# EAGLE design esp8266-dev (EAGLE 7.1.0)
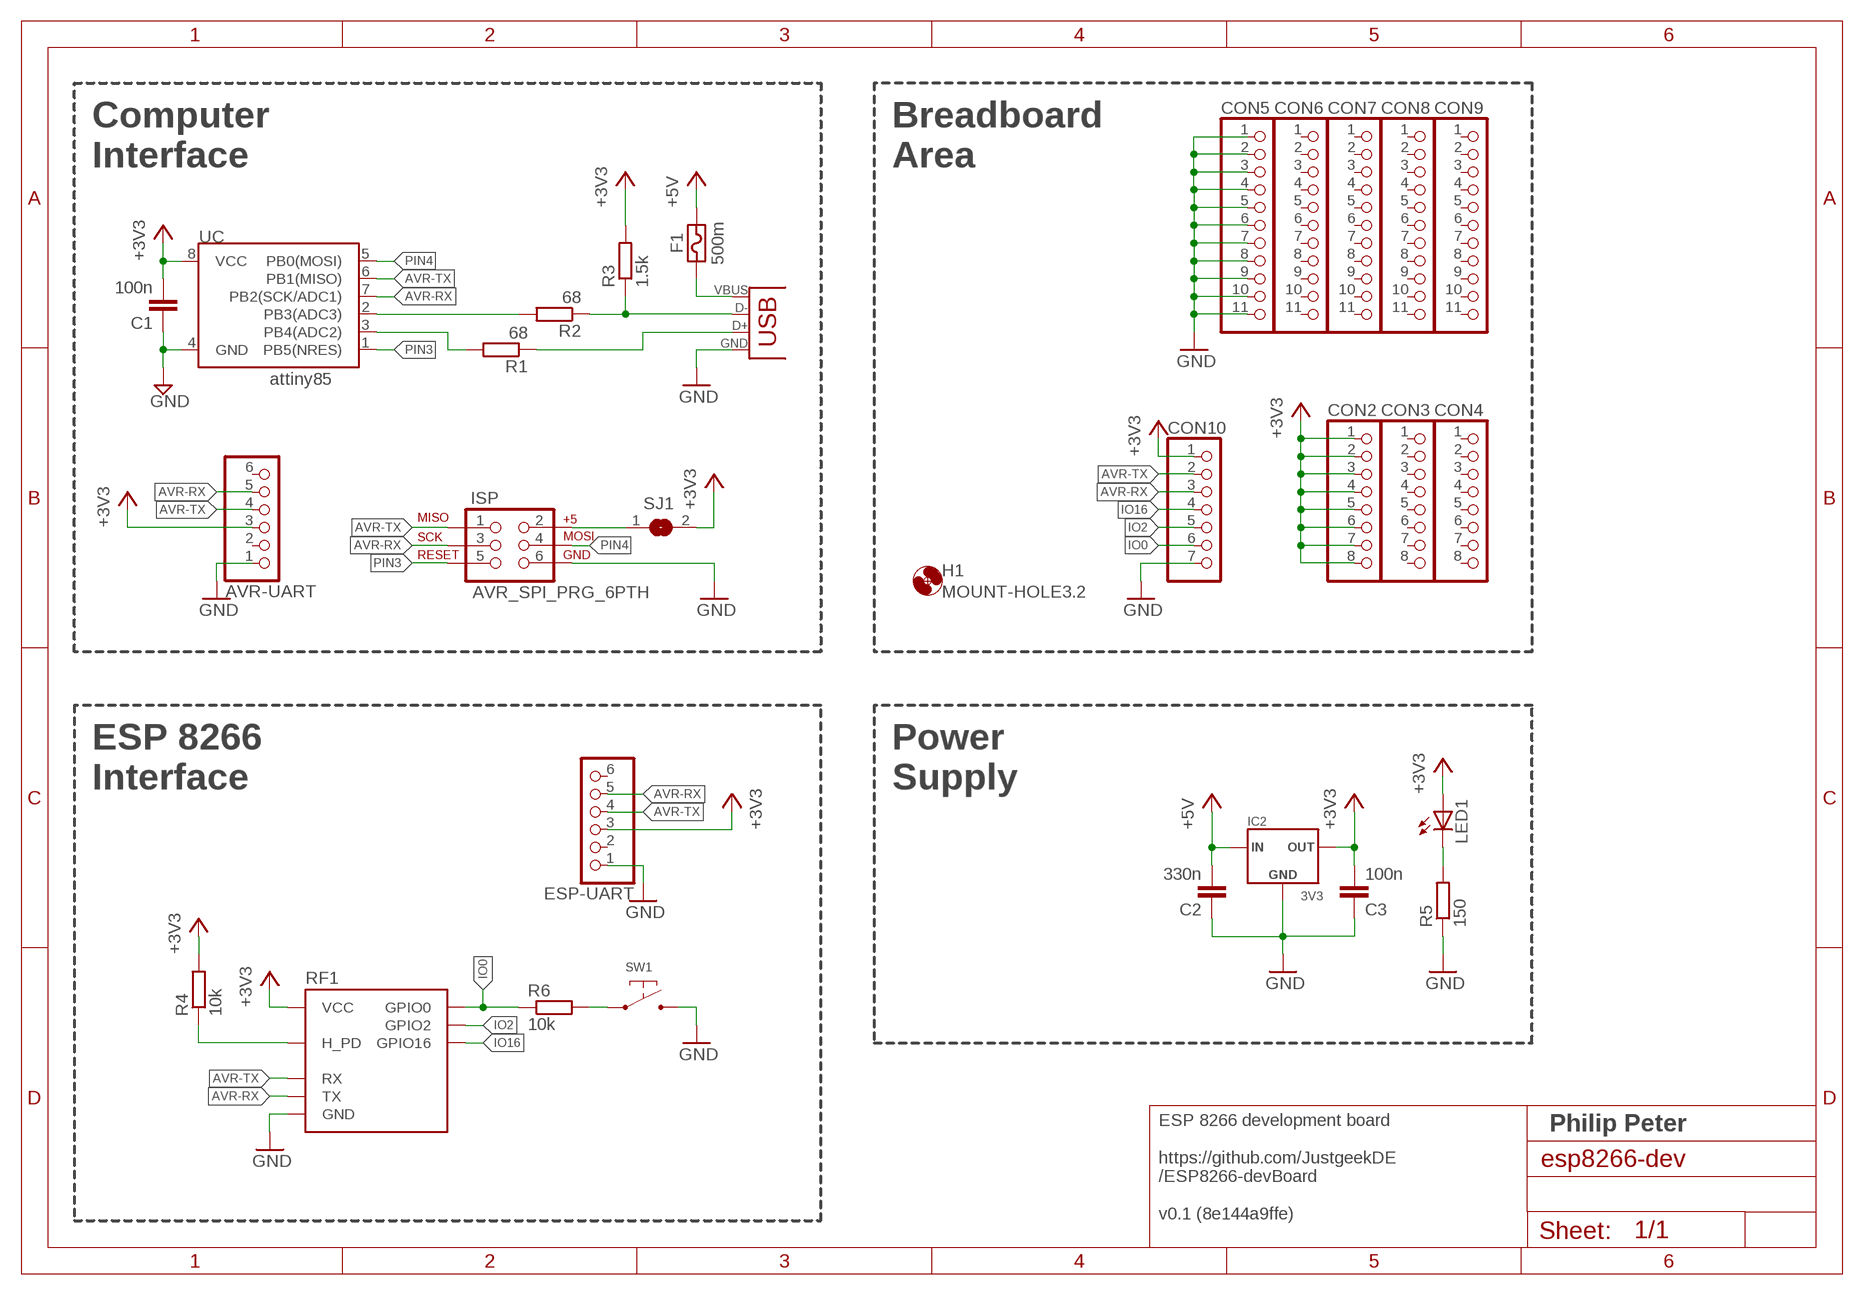
[diagram p0: schematic, sheet 1]

## Parts
AVR-UART  GENERIC-1X6STANDARD  [PINHEADER-100MIL-1X6]
C1  100n  C-EU025-025X050  [C025-025X050]
C2  330n  C-EU025-025X050  [C025-025X050]
C3  100n  C-EU025-025X050  [C025-025X050]
CON1  USBB-SOCKET  [PN61729-S]
CON2  GENERIC-1X8NOSILK  [PINHEADER-100MIL-1X8-NOSILK]
CON3  GENERIC-1X8NOSILK  [PINHEADER-100MIL-1X8-NOSILK]
CON4  GENERIC-1X8NOSILK  [PINHEADER-100MIL-1X8-NOSILK]
CON5  GENERIC-1X11NOSILK  [PINHEADER-100MIL-1X11-NOSILK]
CON6  GENERIC-1X11NOSILK  [PINHEADER-100MIL-1X11-NOSILK]
CON7  GENERIC-1X11NOSILK  [PINHEADER-100MIL-1X11-NOSILK]
CON8  GENERIC-1X11NOSILK  [PINHEADER-100MIL-1X11-NOSILK]
CON9  GENERIC-1X11NOSILK  [PINHEADER-100MIL-1X11-NOSILK]
CON10  GENERIC-1X7NOSILK  [PINHEADER-100MIL-1X7-NOSILK]
ESP-UART  GENERIC-1X6STANDARD  [PINHEADER-100MIL-1X6]
F1  500m  FUSETHT-5.1  [FUSE-THT-100-MIL]
H1  MOUNT-HOLE3.2  [3,2]
IC2  3V3  REGULATOR-UA78M33TO220  [TO220V]
ISP  AVR_SPI_PRG_6PTH  [2X3]
LED1  LED3MM  [LED3MM]
R1  68  R-EU_0204/7  [0204/7]
R2  68  R-EU_0204/7  [0204/7]
R3  1.5k  R-EU_0204/7  [0204/7]
R4  10k  R-EU_0204/7  [0204/7]
R5  150  R-EU_0204/7  [0204/7]
R6  10k  R-EU_0204/7  [0204/7]
RF1  ESP2866-ESP-01THT-NOSILK  [ESP8266-ESP-01-NOSILK]
SJ1  SJ  [SJ]
SW1  SWITCH-DEFAULT_OFF-DEFAULT  [SWITCH-GENERIC-4_PIN]
UC  ATTINY85  ATTINY45DIP8  [DIP08]

## Nets
+3V3: AVR-UART.3 C1.2 C3.2 CON2.1 CON2.2 CON2.3 CON2.4 CON2.5 CON2.6 CON2.7 CON2.8 CON10.1 ESP-UART.3 IC2.3(OUT) LED1.A R3.2 R4.2 RF1.VCC SJ1.2 UC.8(VCC)
+5V: C2.2 F1.P$2 IC2.1(IN)
AVR-RX: AVR-UART.5 CON10.3 ESP-UART.5 ISP.3 RF1.TX UC.7(PB2(SCK/ADC1))
AVR-TX: AVR-UART.4 CON10.2 ESP-UART.4 ISP.1 RF1.RX UC.6(PB1(MISO))
D+: CON1.3(D+) R1.1
D-: CON1.2(D-) R2.1 R3.1
GND: AVR-UART.1 C1.1 C2.1 C3.1 CON1.4(GND) CON5.1 CON5.2 CON5.3 CON5.4 CON5.5 CON5.6 CON5.7 CON5.8 CON5.9 CON5.10 CON5.11 CON10.7 ESP-UART.1 IC2.2(GND) ISP.6 R5.1 RF1.GND SW1.P$3 SW1.P$4 UC.4(GND)
IO0: CON10.6 R6.1 RF1.GPIO0
IO2: CON10.5 RF1.GPIO2
IO16: CON10.4 RF1.GPIO16
N$1: R2.2 UC.2(PB3(ADC3))
N$2: R1.2 UC.3(PB4(ADC2))
N$3: LED1.K(C) R5.2
N$4: CON1.1(VBUS) F1.P$1
N$6: R4.1 RF1.H_PD
N$8: R6.2 SW1.P$1 SW1.P$2
PIN3: ISP.5 UC.1(PB5(NRES))
PIN4: ISP.4 UC.5(PB0(MOSI))
VCC_HEADER: ISP.2 SJ1.1
Unconnected: AVR-UART.2 AVR-UART.6 CON3.1 CON3.2 CON3.3 CON3.4 CON3.5 CON3.6 CON3.7 CON3.8 CON4.1 CON4.2 CON4.3 CON4.4 CON4.5 CON4.6 CON4.7 CON4.8 CON6.1 CON6.2 CON6.3 CON6.4 CON6.5 CON6.6 CON6.7 CON6.8 CON6.9 CON6.10 CON6.11 CON7.1 CON7.2 CON7.3 CON7.4 CON7.5 CON7.6 CON7.7 CON7.8 CON7.9 CON7.10 CON7.11 CON8.1 CON8.2 CON8.3 CON8.4 CON8.5 CON8.6 CON8.7 CON8.8 CON8.9 CON8.10 CON8.11 CON9.1 CON9.2 CON9.3 CON9.4 CON9.5 CON9.6 CON9.7 CON9.8 CON9.9 CON9.10 CON9.11 ESP-UART.2 ESP-UART.6

## Notes on the sheet
- Computer
  Interface
- Breadboard
  Area
- attiny85
- ESP 8266
  Interface
- Power
  Supply
- ESP 8266 development board
  
  https://github.com/JustgeekDE
  /ESP8266-devBoard
  
  v0.1 (8e144a9ffe)
- Philip Peter

## Library data of the parts
AVR-UART ESP-UART = p.peter-connectors:GENERIC-1X6
C1-C3 = rcl:C-EU: CAPACITOR, European symbol
CON1 = p.peter-connectors:USB
CON2-CON4 = p.peter-connectors:GENERIC-1X8
CON5-CON9 = p.peter-connectors:GENERIC-1X11
CON10 = p.peter-connectors:GENERIC-1X7
F1 = p.peter-regulators:FUSE
H1 = holes:MOUNT-HOLE: MOUNTING HOLE with drill center marker
IC2 = p.peter-regulators:REGULATOR-UA78M33
ISP = SparkFun:AVR_SPI_PRG_6: AVR ISP 6 Pin This is the reduced ISP connector for AVR programming. Common on Arduino. This footprint will take up less PCB space and can be used with a 10-pin to 6-pin adapter such as SKU: BOB-08508
LED1 = led:LED: LED OSRAM: - CHIPLED LG R971, LG N971, LY N971, LG Q971, LY Q971, LO R971, LY R971 LH N974, LH R974 LS Q976, LO Q976, LY Q976 LO Q996 - Hyper CHIPLED LW Q18S LB Q993, LB Q99A, LB R99A - SideLED LS A670, LO A670, LY A670, LG A670, LP A670 LB A673, LV A673, LT A673, LW A673 LH A674 LY A675 LS A676, LA A676, LO A676, LY A676, LW A676 LS A679, LY A679, LG A679 - Hyper Micro SIDELED® LS Y876, LA Y876, LO Y876, LY Y876 LT Y87S - SmartLED LW L88C, LW L88S LB L89C, LB L89S, LG L890 LS L89K, LO L89K, LY L89K LS L896, LA L896, LO L896, LY L896 - TOPLED LS T670, LO T670, LY T670, LG T670, LP T670 LSG T670, LSP T670, LSY T670, LOP T670, LYG T670 LG T671, LOG T671, LSG T671 LB T673, LV T673, LT T673, LW T673 LH T674 LS T676, LA T676, LO T676, LY T676, LB T676, LH T676, LSB T676, LW T676 LB T67C, LV T67C, LT T67C, LS T67K, LO T67K, LY T67K, LW E67C LS E67B, LA E67B, LO E67B, LY E67B, LB E67C, LV E67C, LT E67C LW T67C LS T679, LY T679, LG T679 LS T770, LO T770, LY T770, LG T770, LP T770 LB T773, LV T773, LT T773, LW T773 LH T774 LS E675, LA E675, LY E675, LS T675 LS T776, LA T776, LO T776, LY T776, LB T776 LHGB T686 LT T68C, LB T68C - Hyper Mini TOPLED® LB M676 - Mini TOPLED Santana® LG M470 LS M47K, LO M47K, LY M47K Source: http://www.osram.convergy.de LUXEON: - LUMILED® LXK2-PW12-R00, LXK2-PW12-S00, LXK2-PW14-U00, LXK2-PW14-V00 LXK2-PM12-R00, LXK2-PM12-S00, LXK2-PM14-U00 LXK2-PE12-Q00, LXK2-PE12-R00, LXK2-PE12-S00, LXK2-PE14-T00, LXK2-PE14-U00 LXK2-PB12-K00, LXK2-PB12-L00, LXK2-PB12-M00, LXK2-PB14-N00, LXK2-PB14-P00, LXK2-PB14-Q00 LXK2-PR12-L00, LXK2-PR12-M00, LXK2-PR14-Q00, LXK2-PR14-R00 LXK2-PD12-Q00, LXK2-PD12-R00, LXK2-PD12-S00 LXK2-PH12-R00, LXK2-PH12-S00 LXK2-PL12-P00, LXK2-PL12-Q00, LXK2-PL12-R00 Source: www.luxeon.com KINGBRIGHT: KA-3528ASYC Source: www.kingbright.com
R1-R6 = rcl:R-EU_: RESISTOR, European symbol
RF1 = p.peter-periphery:ESP2866-ESP-01
SJ1 = jumper:SJ: SMD solder JUMPER
SW1 = p.peter-passives:SWITCH-DEFAULT_OFF
UC = SparkFun:ATTINY45: Atmel ATTiny45

## Board
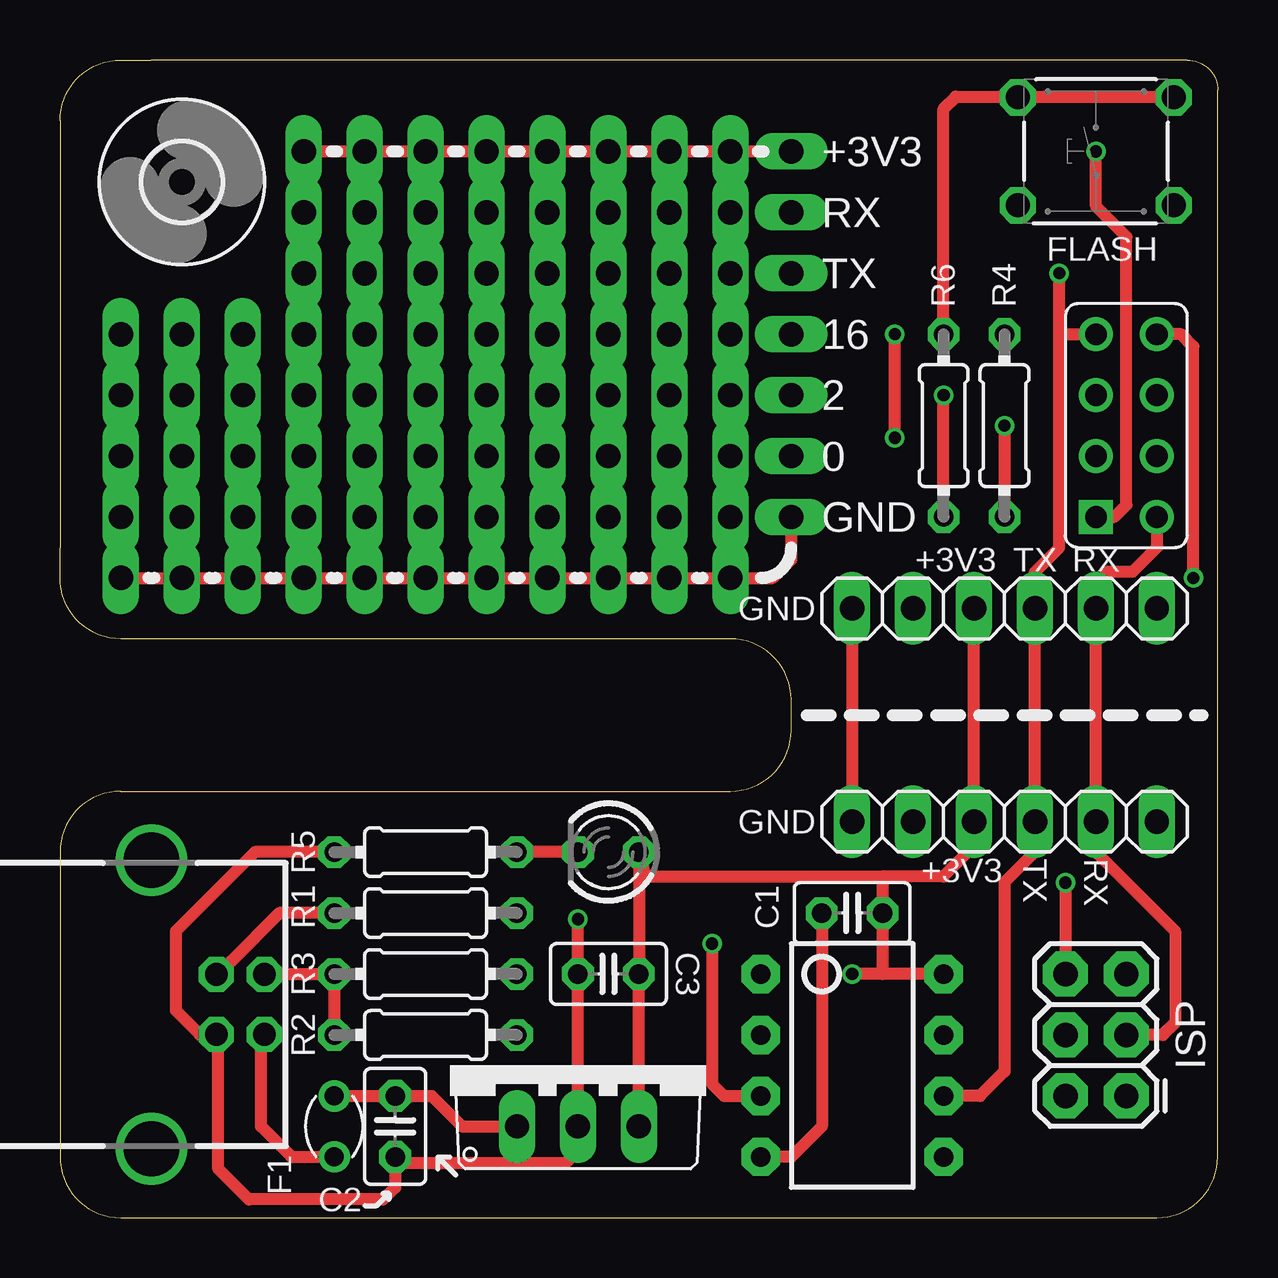
[diagram p1: board, top side]
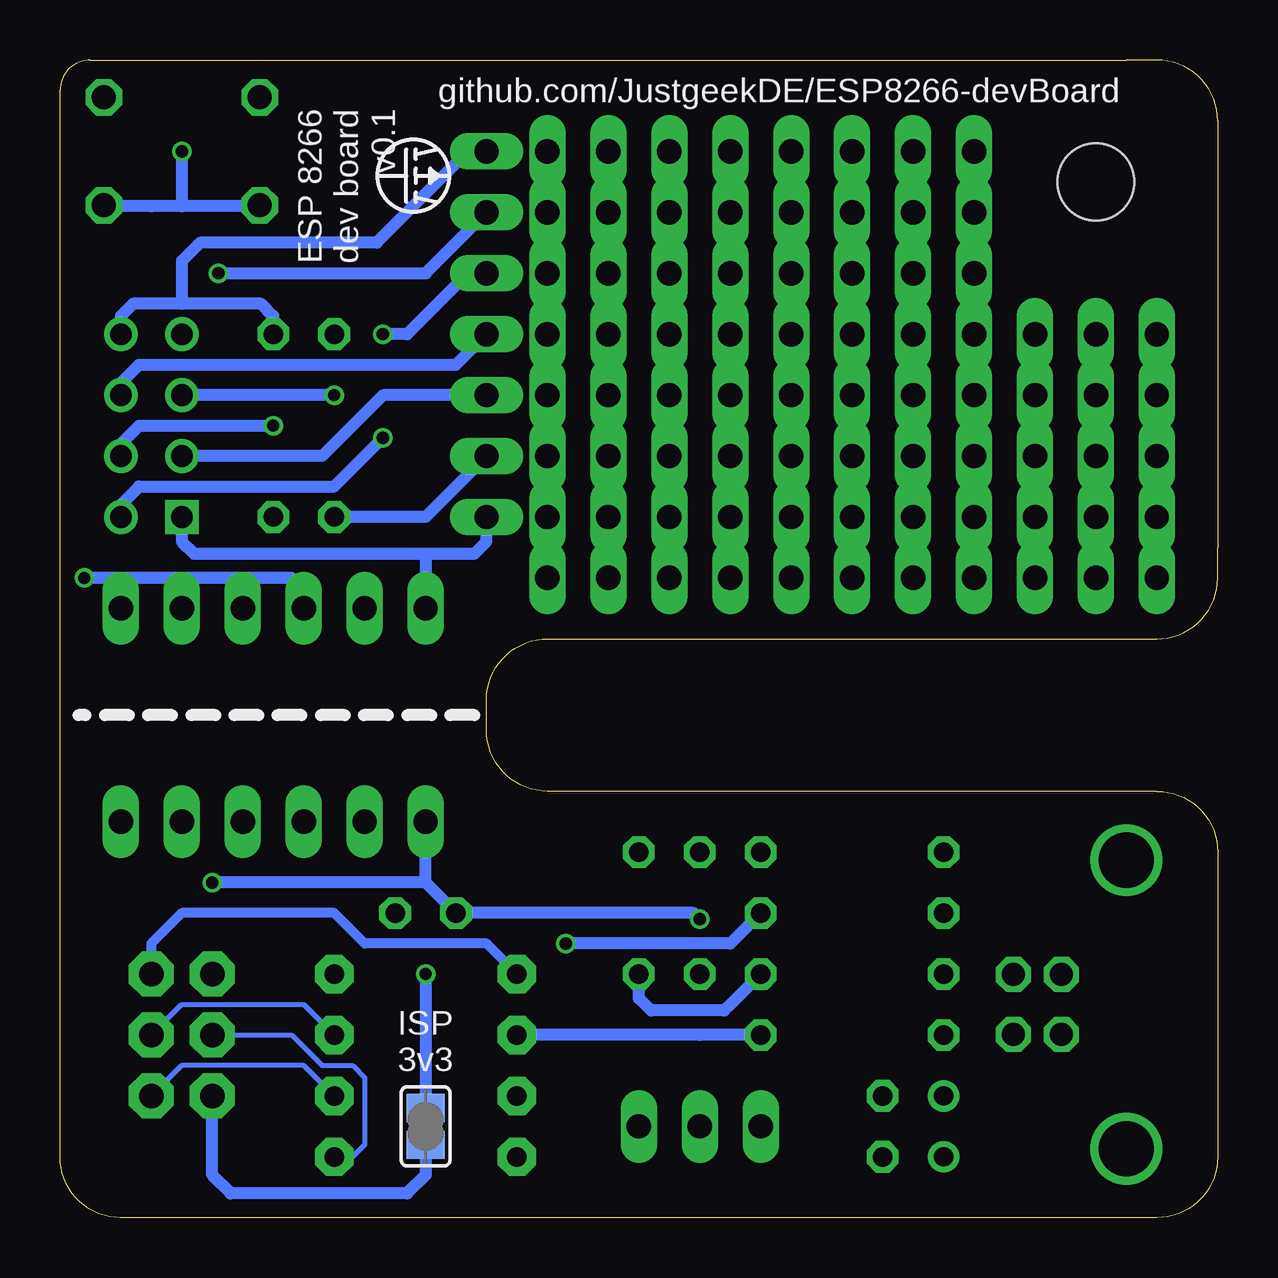
[diagram p2: board, bottom side, seen from below]

Size 48.26 x 48.26 mm. Coordinates in mm from the lower left corner, seen from the top.
Outline: 30.48,20.32 30.48,21.59
Outline: 30.48,20.32 arc-90 27.94,17.78 2.54,17.78 arc90 0,15.24 0,2.54 arc90 2.54,0 3.81,0 45.72,0 arc90 48.26,2.54 48.26,3.81 48.26,46.99 arc90 46.99,48.26 3.81,48.26 2.54,48.26 arc90 0,45.72 0,27.94 0,26.67 arc90 2.54,24.13 26.67,24.13 27.94,24.13 arc-90 30.48,21.59
Outline: 30.48,20.32 30.48,21.59
Copper layers (1*16): Top 0.035mm / dielectric 1.5mm / Bottom 0.035mm
Design rules "Elecrow_2-layer_eagle_rule *": minimum track width 6mil, minimum drill 12mil, track to track 6mil, track to pad 6mil, pad to pad 6mil, via to via 6mil, smd to smd 0mil, copper to edge 10mil, drill to drill 10mil, minimum pad ring 10mil, minimum via ring 6mil, stop-mask expansion 2mil, vias tented up to drill 100mil, thermal gap 10mil

### Footprints (pad centres in the part's own frame; a part is rotated, then mirrored left to right if it is on the bottom)
PINHEADER-100MIL-1X6 = drill 1.016 long: 1 -6.35,0; 2 -3.81,0; 3 -1.27,0; 4 1.27,0; 5 3.81,0; 6 6.35,0
C025-025X050 = drill 0.813 octagon: 1 -1.27,0; 2 1.27,0
PN61729-S = drill 0.95 octagon: 1 1.25,4.71; 2 -1.25,4.71; 3 -1.25,2.71; 4 1.25,2.71 | drill 2.3 pad 2.9: S1 -6.02,0; S2 6.02,0
PINHEADER-100MIL-1X8-NOSILK = drill 1.016 long: 1 -8.89,0; 2 -6.35,0; 3 -3.81,0; 4 -1.27,0; 5 1.27,0; 6 3.81,0; 7 6.35,0; 8 8.89,0
PINHEADER-100MIL-1X11-NOSILK = drill 1.016 long: 1 -12.7,0; 2 -10.16,0; 3 -7.62,0; 4 -5.08,0; 5 -2.54,0; 6 0,0; 7 2.54,0; 8 5.08,0; 9 7.62,0; 10 10.16,0; 11 12.7,0
PINHEADER-100MIL-1X7-NOSILK = drill 1.016 long: 1 -7.62,0; 2 -5.08,0; 3 -2.54,0; 4 0,0; 5 2.54,0; 6 5.08,0; 7 7.62,0
FUSE-THT-100-MIL = drill 0.8: P$1 -1.27,0; P$2 1.27,0
3,2 = hole 3.2: 0,0
TO220V = drill 1.016 long: 1 -2.54,-2.54; 2 0,-2.54; 3 2.54,-2.54
2X3 = drill 1.016 pad 1.88 octagon: 1 0,0; 2 0,2.54; 3 2.54,0; 4 2.54,2.54; 5 5.08,0; 6 5.08,2.54
LED3MM = drill 0.813 octagon: A -1.27,0; K 1.27,0
0204/7 = drill 0.813 octagon: 1 -3.81,0; 2 3.81,0
ESP8266-ESP-01-NOSILK = drill 0.9 square: GND 1.27,3.81 | drill 0.9: GPIO0 1.27,-1.27; GPIO2 1.27,1.27; GPIO16 -1.27,-1.27; H_PD -1.27,1.27; RX 1.27,-3.81; TX -1.27,3.81; VCC -1.27,-3.81
SJ = smd 1.168 x 1.6: 1 -0.762,0; 2 0.762,0
SWITCH-GENERIC-4_PIN = drill 1 octagon: P$1 2.25,3.25; P$2 2.25,-3.25; P$3 -2.25,3.25; P$4 -2.25,-3.25
DIP08 = drill 0.813 pad 1.6 octagon: 1 -3.81,-3.81; 2 -1.27,-3.81; 3 1.27,-3.81; 4 3.81,-3.81; 5 3.81,3.81; 6 1.27,3.81; 7 -1.27,3.81; 8 -3.81,3.81

### Placement (x,y rotation side)
AVR-UART  39.37,16.51 0 top
C1  33.02,12.7 0 top
C2  13.97,3.81 90 top
C3  22.86,10.16 0 top
CON1  3.81,8.89 270 top
CON2  19.05,44.45 0 top
CON3  19.05,41.91 0 top
CON4  19.05,39.37 0 top
CON5  15.24,26.67 0 top
CON6  15.24,34.29 0 top
CON7  15.24,31.75 0 top
CON8  15.24,29.21 0 top
CON9  15.24,36.83 0 top
CON10  30.48,36.83 270 top
ESP-UART  39.37,25.4 0 top
F1  11.43,3.81 90 top
H1  5.08,43.18 0 top
IC2  21.59,6.35 0 top
ISP  44.45,5.08 90 top
LED1  22.86,15.24 180 top
R1  15.24,12.7 0 top
R2  15.24,7.62 0 top
R3  15.24,10.16 0 top
R4  39.37,33.02 90 top
R5  15.24,15.24 0 top
R6  36.83,33.02 90 top
RF1  44.45,33.02 180 top
SJ1  33.02,3.81 90 bottom
SW1  43.18,44.45 90 top
U$3  [LOGO-JUSTGEEK-XXXS]  33.53,43.43 90 bottom
UC  33.02,6.35 270 top

### Tracks (layer width: path | path; a pad name or v marks a point on that pad's centre or on a via)
+3V3  (via drill 0.51)
  Top 0.508: 34.29,14.22 C1.2 34.29,10.16 | 34.29,14.22 36.83,14.22 38.1,15.49 AVR-UART.3 ESP-UART.3 | UC.8 34.29,10.16 | 34.29,10.16 v33.02,10.16 | v47.24,26.67 47.24,36.32 46.74,36.83 RF1.VCC | IC2.3 C3.2 LED1.A 24.38,14.22 34.29,14.22 | CON2.1 CON2.2 CON2.3 CON2.4 CON2.5 CON2.6 CON2.7 CON2.8 CON10.1
  Bottom 0.508: v33.02,10.16 SJ1.2 | v47.24,26.67 38.61,26.67 38.1,26.16 ESP-UART.3 | R4.2 39.37,37.59 39.88,38.1 43.18,38.1 | 43.18,38.1 45.21,38.1 45.72,37.59 RF1.VCC | CON10.1 31.24,44.45 35.05,40.64 42.42,40.64 43.18,39.88 43.18,38.1 | R3.2 20.07,9.14 20.32,8.89 20.57,8.64 23.62,8.64 24.13,9.14 24.13,9.91 | 24.13,9.91 C3.2 24.13,9.91
+5V
  Top 0.508: F1.P$2 C2.2 15.49,5.08 16.76,3.81 IC2.1
AVR-RX  (via drill 0.51)
  Top 0.508: ISP.3 45.97,7.62 46.48,8.13 46.48,11.94 43.18,15.24 AVR-UART.5 ESP-UART.5 43.18,26.42 43.69,26.92 44.7,26.92 45.72,27.94 RF1.TX | v34.8,32.51 v34.8,36.83
  Bottom 0.203: ISP.3 43.18,8.89 38.1,8.89 UC.7
  Bottom 0.508: RF1.TX 45.72,29.72 44.96,30.48 36.83,30.48 v34.8,32.51 | CON10.3 31.24,39.37 33.78,36.83 v34.8,36.83
AVR-TX  (via drill 0.51)
  Top 0.508: UC.6 38.35,5.08 39.37,6.1 39.37,13.97 40.64,15.24 AVR-UART.4 ESP-UART.4 40.64,26.92 41.66,27.94 41.66,36.83 | 41.66,36.83 RF1.RX | 41.66,36.83 v41.66,39.37
  Bottom 0.203: ISP.1 43.18,6.35 38.1,6.35 UC.6
  Bottom 0.508: v41.66,39.37 33.02,39.37 CON10.2
D+
  Top 0.508: R1.1 9.14,12.7 7.11,10.67 CON1.3
D-
  Top 0.508: CON1.2 8.64,10.16 R3.1 R2.1
GND  (via drill 0.51)
  Top 0.508: C1.1 31.75,3.81 30.48,2.54 UC.4 | v41.91,13.97 ISP.6 | ESP-UART.1 AVR-UART.1 | RF1.GND 43.94,29.21 44.45,29.72 44.45,40.89 43.18,42.16 v43.18,44.45 | R5.1 8.13,15.24 4.83,11.94 4.83,8.64 5.84,7.62 6.6,7.62 | v21.59,12.45 C3.1 IC2.2 21.59,2.79 21.08,2.29 14.22,2.29 C2.1 13.97,1.27 13.46,0.76 7.87,0.76 6.6,2.03 6.6,7.62 | 6.6,7.62 CON1.4 6.6,7.62 | CON5.1 CON5.2 CON5.3 CON5.4 CON5.5 CON5.6 CON5.7 CON5.8 CON5.9 CON5.10 CON5.11 29.72,26.67 30.48,27.43 CON10.7
  Bottom 0.508: 33.02,13.97 C1.1 21.84,12.7 v21.59,12.45 | 33.02,13.97 v41.91,13.97 | RF1.GND 43.18,28.19 42.67,27.69 33.02,27.69 | SW1.P$3 39.88,42.16 43.18,42.16 | 43.18,42.16 44.45,42.16 46.48,42.16 SW1.P$4 | 33.02,27.69 ESP-UART.1 | 33.02,13.97 AVR-UART.1 | 33.02,27.69 30.99,27.69 30.48,28.19 CON10.7 | v43.18,44.45 43.18,42.16
IO0  (via drill 0.51)
  Top 0.508: R6.1 v36.83,34.29
  Bottom 0.508: v36.83,34.29 RF1.GPIO0 | CON10.6 33.02,29.21 R6.1
IO2
  Bottom 0.508: CON10.5 34.8,34.29 37.34,31.75 RF1.GPIO2
IO16
  Bottom 0.508: RF1.GPIO16 45.72,34.8 44.96,35.56 31.75,35.56 CON10.4
N$1
  Bottom 0.508: R2.2 21.59,7.62 UC.2
N$2  (via drill 0.51)
  Top 0.508: v27.18,11.43 27.18,5.59 27.69,5.08 UC.3
  Bottom 0.508: R1.2 20.32,11.43 v27.18,11.43
N$3
  Top 0.508: LED1.K R5.2
N$4
  Top 0.508: F1.P$1 9.65,2.54 8.38,3.81 8.38,7.62 CON1.1
N$6  (via drill 0.51)
  Top 0.508: v39.37,33.02 R4.1
  Bottom 0.508: RF1.H_PD 45.72,32.26 44.96,33.02 v39.37,33.02
N$8
  Top 0.508: R6.2 36.83,46.23 37.34,46.74 39.88,46.74 | 39.88,46.74 SW1.P$1 39.88,46.74 | 39.88,46.74 46.48,46.74 SW1.P$2
PIN3
  Bottom 0.406: UC.1 30.48,11.43 35.56,11.43 36.83,12.7 43.18,12.7 44.45,11.43 ISP.5
PIN4
  Bottom 0.203: ISP.4 38.61,7.62 37.34,6.35 36.07,6.35 35.56,5.84 35.56,3.05 36.07,2.54 UC.5
VCC_HEADER
  Bottom 0.508: SJ1.1 33.02,1.78 33.78,1.02 41.15,1.02 41.91,1.78 ISP.2

### Text on the board
tPlace: +3V3 | RX | FLASH | TX | 16 | 2 | 0 | GND | +3V3 | TX | RX | GND | GND | +3V3 | TX | RX
bPlace: github.com/JustgeekDE/ESP8266-devBoard | ESP 8266 / dev board / v0.1 | ISP / 3v3